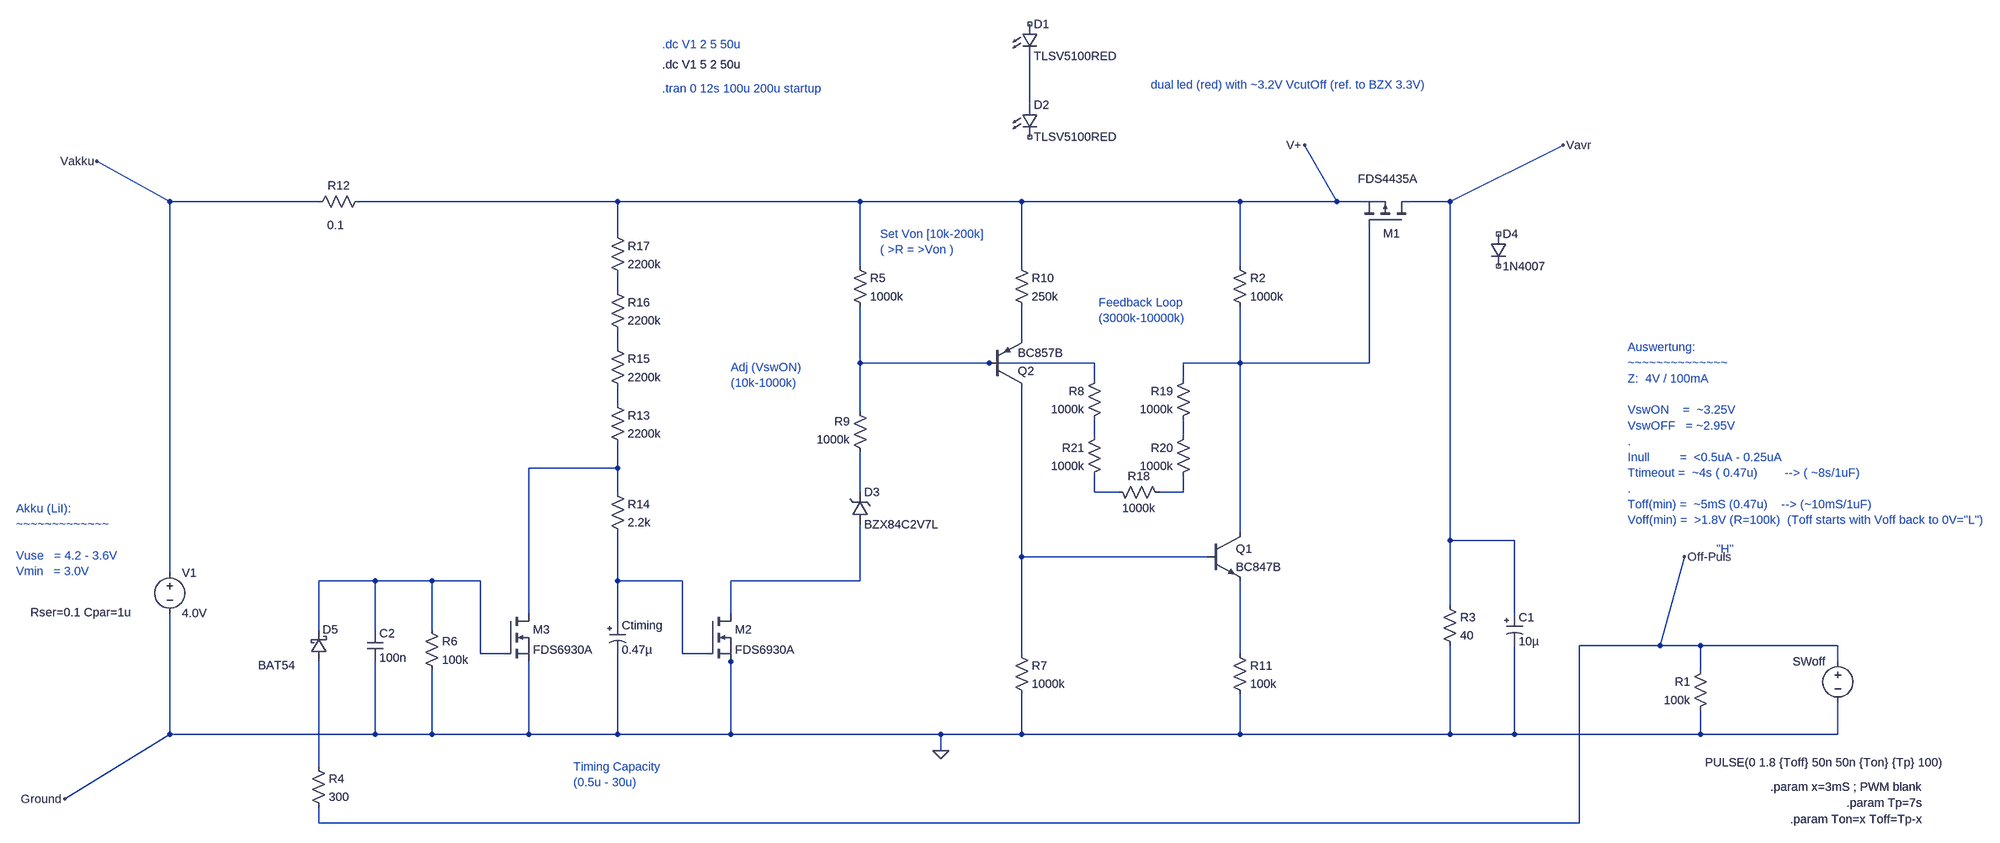
[diagram p0: schematic V0_SW23p.asc]
V0_SW23p.asc, the LTspice schematic file:
Version 4
SHEET 1 2908 768
WIRE 928 -752 928 -848
WIRE -800 -560 -944 -640
WIRE -480 -560 -800 -560
WIRE 112 -560 -400 -560
WIRE 592 -560 112 -560
WIRE 912 -560 592 -560
WIRE 1344 -560 912 -560
WIRE 1536 -560 1472 -672
WIRE 1536 -560 1344 -560
WIRE 1584 -560 1536 -560
WIRE 1760 -560 1984 -672
WIRE 1760 -560 1680 -560
WIRE 112 -496 112 -560
WIRE 592 -432 592 -560
WIRE 912 -432 912 -560
WIRE 1344 -432 1344 -560
WIRE 112 -384 112 -416
WIRE 912 -288 912 -352
WIRE 112 -272 112 -304
WIRE 592 -240 592 -352
WIRE 848 -240 592 -240
WIRE 1056 -240 848 -240
WIRE 1344 -240 1344 -352
WIRE 1344 -240 1232 -240
WIRE 1600 -240 1600 -512
WIRE 1600 -240 1344 -240
WIRE 1056 -208 1056 -240
WIRE 1232 -208 1232 -240
WIRE 112 -160 112 -192
WIRE 592 -144 592 -240
WIRE 1056 -96 1056 -128
WIRE 1232 -96 1232 -128
WIRE 112 -32 112 -80
WIRE 112 -32 -64 -32
WIRE 112 16 112 -32
WIRE 592 16 592 -64
WIRE 1056 16 1056 -16
WIRE 1104 16 1056 16
WIRE 1232 16 1232 -16
WIRE 1232 16 1184 16
WIRE 1344 96 1344 -240
WIRE 1760 112 1760 -560
WIRE 1888 112 1760 112
WIRE 912 144 912 -192
WIRE 1280 144 912 144
WIRE -800 176 -800 -560
WIRE -368 192 -480 192
WIRE -256 192 -368 192
WIRE -160 192 -256 192
WIRE 112 192 112 96
WIRE 240 192 112 192
WIRE 592 192 592 80
WIRE 592 192 336 192
WIRE 1760 240 1760 112
WIRE -64 256 -64 -32
WIRE 336 256 336 192
WIRE 1888 256 1888 112
WIRE 112 272 112 192
WIRE -480 288 -480 192
WIRE -368 288 -368 192
WIRE -256 288 -256 192
WIRE 2176 320 2224 144
WIRE 2176 320 2016 320
WIRE 2256 320 2176 320
WIRE 2528 320 2256 320
WIRE -160 336 -160 192
WIRE -112 336 -160 336
WIRE 240 336 240 192
WIRE 288 336 240 336
WIRE 912 336 912 144
WIRE 1344 336 1344 192
WIRE 336 352 336 320
WIRE 2528 352 2528 320
WIRE 2256 368 2256 320
WIRE -800 496 -800 256
WIRE -368 496 -368 352
WIRE -368 496 -800 496
WIRE -256 496 -256 368
WIRE -256 496 -368 496
WIRE -64 496 -64 352
WIRE -64 496 -256 496
WIRE 112 496 112 336
WIRE 112 496 -64 496
WIRE 336 496 336 352
WIRE 336 496 112 496
WIRE 752 496 336 496
WIRE 912 496 912 416
WIRE 912 496 752 496
WIRE 1344 496 1344 416
WIRE 1344 496 912 496
WIRE 1760 496 1760 320
WIRE 1760 496 1344 496
WIRE 1888 496 1888 320
WIRE 1888 496 1760 496
WIRE 2256 496 2256 448
WIRE 2256 496 1888 496
WIRE 2528 496 2528 432
WIRE 2528 496 2256 496
WIRE 752 528 752 496
WIRE -480 560 -480 352
WIRE -1008 624 -800 496
WIRE -480 672 -480 640
WIRE 2016 672 2016 320
WIRE 2016 672 -480 672
FLAG 752 528 0
FLAG 1984 -672 Vavr
FLAG 2224 144 Off-Puls
FLAG 1472 -672 V+
FLAG -1008 624 Ground
FLAG -944 -640 Vakku
SYMBOL res 576 -448 R0
SYMATTR InstName R5
SYMATTR Value 1000k
SYMBOL res 1744 224 R0
SYMATTR InstName R3
SYMATTR Value 40
SYMBOL voltage -800 160 R0
WINDOW 123 0 0 Left 0
WINDOW 39 -276 94 Left 2
SYMATTR SpiceLine Rser=0.1 Cpar=1u
SYMATTR InstName V1
SYMATTR Value 4.0V
SYMBOL pnp 848 -192 M180
SYMATTR InstName Q2
SYMATTR Value BC857B
SYMBOL res 896 320 R0
SYMATTR InstName R7
SYMATTR Value 1000k
SYMBOL npn 1280 96 R0
SYMATTR InstName Q1
SYMATTR Value BC847B
SYMBOL res 1328 -448 R0
SYMATTR InstName R2
SYMATTR Value 1000k
SYMBOL res 1072 -224 M0
SYMATTR InstName R8
SYMATTR Value 1000k
SYMATTR SpiceLine tol=1 pwr=0.125
SYMBOL res 608 -48 R180
WINDOW 0 36 76 Left 2
WINDOW 3 36 40 Left 2
SYMATTR InstName R9
SYMATTR Value 1000k
SYMBOL res 896 -448 R0
SYMATTR InstName R10
SYMATTR Value 250k
SYMBOL res -384 -576 R90
WINDOW 0 0 56 VBottom 2
WINDOW 3 47 62 VTop 2
SYMATTR InstName R12
SYMATTR Value 0.1
SYMBOL res 1328 320 R0
SYMATTR InstName R11
SYMATTR Value 100k
SYMBOL LED 912 -912 R0
SYMATTR InstName D1
SYMATTR Value TLSV5100RED
SYMBOL LED 912 -752 R0
SYMATTR InstName D2
SYMATTR Value TLSV5100RED
SYMBOL zener 576 80 M180
WINDOW 0 24 64 Left 2
WINDOW 3 24 0 Left 2
SYMATTR InstName D3
SYMATTR Value BZX84C2V7L
SYMATTR Description Diode
SYMATTR Type diode
SYMBOL pmos 1680 -512 M270
WINDOW 0 -15 52 VLeft 2
WINDOW 3 93 102 VLeft 2
SYMATTR InstName M1
SYMATTR Value FDS4435A
SYMBOL voltage 2528 336 M0
WINDOW 3 -210 216 Left 2
WINDOW 123 0 0 Left 0
WINDOW 39 0 0 Left 0
SYMATTR Value PULSE(0 1.8 {Toff} 50n 50n {Ton} {Tp} 100)
SYMATTR InstName SWoff
SYMBOL res 2272 352 M0
SYMATTR InstName R1
SYMATTR Value 100k
SYMBOL nmos 288 256 R0
SYMATTR InstName M2
SYMATTR Value FDS6930A
SYMBOL res 96 -176 R0
SYMATTR InstName R13
SYMATTR Value 2200k
SYMBOL nmos -112 256 R0
SYMATTR InstName M3
SYMATTR Value FDS6930A
SYMBOL res -272 272 R0
SYMATTR InstName R6
SYMATTR Value 100k
SYMBOL res 96 0 R0
SYMATTR InstName R14
SYMATTR Value 2.2k
SYMBOL diode 1840 -496 R0
SYMATTR InstName D4
SYMATTR Value 1N4007
SYMBOL polcap 96 272 R0
WINDOW 3 24 56 Left 2
SYMATTR Value 0.47µ
SYMATTR InstName Ctiming
SYMATTR Description Capacitor
SYMATTR Type cap
SYMATTR SpiceLine V=100 Irms=10m Rser=43 Lser=0 mfg="Nichicon" pn="UPR2AR47MAH" type="Al electrolytic"
SYMBOL polcap 1872 256 R0
WINDOW 3 24 56 Left 2
SYMATTR Value 10µ
SYMATTR InstName C1
SYMATTR Description Capacitor
SYMATTR Type cap
SYMATTR SpiceLine V=12.5 Irms=2.12132 Rser=0.06 Lser=0 mfg="KEMET" pn="A700V106M12RATE060" type="Al electrolytic"
SYMBOL res -496 544 R0
SYMATTR InstName R4
SYMATTR Value 300
SYMBOL schottky -496 352 M180
WINDOW 0 24 64 Left 2
WINDOW 3 -104 -7 Left 2
SYMATTR InstName D5
SYMATTR Value BAT54
SYMATTR Description Diode
SYMATTR Type diode
SYMBOL cap -384 288 R0
SYMATTR InstName C2
SYMATTR Value 100n
SYMBOL res 96 -288 R0
SYMATTR InstName R15
SYMATTR Value 2200k
SYMBOL res 96 -400 R0
SYMATTR InstName R16
SYMATTR Value 2200k
SYMBOL res 96 -512 R0
SYMATTR InstName R17
SYMATTR Value 2200k
SYMBOL res 1088 0 M90
WINDOW 0 0 56 VBottom 2
WINDOW 3 32 56 VTop 2
SYMATTR InstName R18
SYMATTR Value 1000k
SYMATTR SpiceLine tol=1 pwr=0.125
SYMBOL res 1248 -224 M0
SYMATTR InstName R19
SYMATTR Value 1000k
SYMATTR SpiceLine tol=1 pwr=0.125
SYMBOL res 1248 -112 M0
SYMATTR InstName R20
SYMATTR Value 1000k
SYMATTR SpiceLine tol=1 pwr=0.125
SYMBOL res 1072 -112 M0
SYMATTR InstName R21
SYMATTR Value 1000k
SYMATTR SpiceLine tol=1 pwr=0.125
TEXT 200 -872 Left 2 ;.dc V1 2 5 50u
TEXT 200 -832 Left 2 !.dc V1 5 2 50u
TEXT 632 -496 Left 2 ;Set Von [10k-200k]\n( >R = >Von )
TEXT 1064 -360 Left 2 ;Feedback Loop\n(3000k-10000k)
TEXT 2112 -272 Left 2 ;Auswertung: \n~~~~~~~~~~~~~~\nZ:  4V / 100mA \n \nVswON    =  ~3.25V\nVswOFF   = ~2.95V\n.\nInull         =  <0.5uA - 0.25uA\nTtimeout =  ~4s ( 0.47u)        --> ( ~8s/1uF)\n. \nToff(min) =  ~5mS (0.47u)    --> (~10mS/1uF)\nVoff(min) =  >1.8V (R=100k)  (Toff starts with Voff back to 0V="L")
TEXT 336 -232 Left 2 ;Adj (VswON)\n(10k-1000k)
TEXT 200 -784 Left 2 ;.tran 0 12s 100u 200u startup
TEXT 2696 600 Right 2 !.param x=3mS ; PWM blank
TEXT 2696 664 Right 2 !.param Ton=x Toff=Tp-x
TEXT 2696 632 Right 2 !.param Tp=7s
TEXT 1168 -792 Left 2 ;dual led (red) with ~3.2V VcutOff (ref. to BZX 3.3V)
TEXT -1104 48 Left 2 ;Akku (LiI):\n~~~~~~~~~~~~~\n \nVuse   = 4.2 - 3.6V\nVmin   = 3.0V
TEXT 24 560 Left 2 ;Timing Capacity\n(0.5u - 30u)
TEXT 2288 128 Left 2 ;"H"

The netlist it stands for:
* V0_SW23p.asc
R5 V+ N005 1000k
R3 Vavr 0 40
V1 Vakku 0 4.0V Rser=0.1 Cpar=1u
Q2 N014 N005 N003 0 BC857B
R7 N014 0 1000k
Q1 N006 N014 N018 0 BC847B
R2 V+ N006 1000k
R8 N005 N008 1000k tol=1 pwr=0.125
R9 N011 N005 1000k
R10 V+ N003 250k
R12 V+ Vakku 0.1
R11 N018 0 100k
D1 NC_01 N001 TLSV5100RED
D2 N001 NC_02 TLSV5100RED
D3 N017 N011 BZX84C2V7L
M1 Vavr N006 V+ V+ FDS4435A
V§SWoff Off-Puls 0 PULSE(0 1.8 {Toff} 50n 50n {Ton} {Tp} 100)
R1 Off-Puls 0 100k
M2 N017 N016 0 0 FDS6930A
R13 N007 N010 2200k
M3 N010 N015 0 0 FDS6930A
R6 N015 0 100k
R14 N010 N016 2.2k
D4 NC_03 NC_04 1N4007
Ctiming N016 0 0.47µ V=100 Irms=10m Rser=43 Lser=0 mfg="Nichicon" pn="UPR2AR47MAH" type="Al electrolytic"
C1 Vavr 0 10µ V=12.5 Irms=2.12132 Rser=0.06 Lser=0 mfg="KEMET" pn="A700V106M12RATE060" type="Al electrolytic"
R4 N019 Off-Puls 300
D5 N019 N015 BAT54
C2 N015 0 100n
R15 N004 N007 2200k
R16 N002 N004 2200k
R17 V+ N002 2200k
R18 N012 N013 1000k tol=1 pwr=0.125
R19 N006 N009 1000k tol=1 pwr=0.125
R20 N009 N013 1000k tol=1 pwr=0.125
R21 N008 N012 1000k tol=1 pwr=0.125
.model D D
.lib standard.dio
.model NPN NPN
.model PNP PNP
.lib standard.bjt
.model NMOS NMOS
.model PMOS PMOS
.lib standard.mos
* .dc V1 2 5 50u
.dc V1 5 2 50u
* Set Von [10k-200k]
* ( >R = >Von )
* Feedback Loop
* (3000k-10000k)
* Auswertung:
* ~~~~~~~~~~~~~~
* Z:  4V / 100mA
* VswON    =  ~3.25V
* VswOFF   = ~2.95V
* .
* Inull         =  <0.5uA - 0.25uA
* Ttimeout =  ~4s ( 0.47u)        --> ( ~8s/1uF)
* .
* Toff(min) =  ~5mS (0.47u)    --> (~10mS/1uF)
* Voff(min) =  >1.8V (R=100k)  (Toff starts with Voff back to 0V="L")
* Adj (VswON)
* (10k-1000k)
* .tran 0 12s 100u 200u startup
.param x=3mS ; PWM blank
.param Ton=x Toff=Tp-x
.param Tp=7s
* dual led (red) with ~3.2V VcutOff (ref. to BZX 3.3V)
* Akku (LiI):
* ~~~~~~~~~~~~~
* Vuse   = 4.2 - 3.6V
* Vmin   = 3.0V
* Timing Capacity
* (0.5u - 30u)
* "H"
.backanno
.end